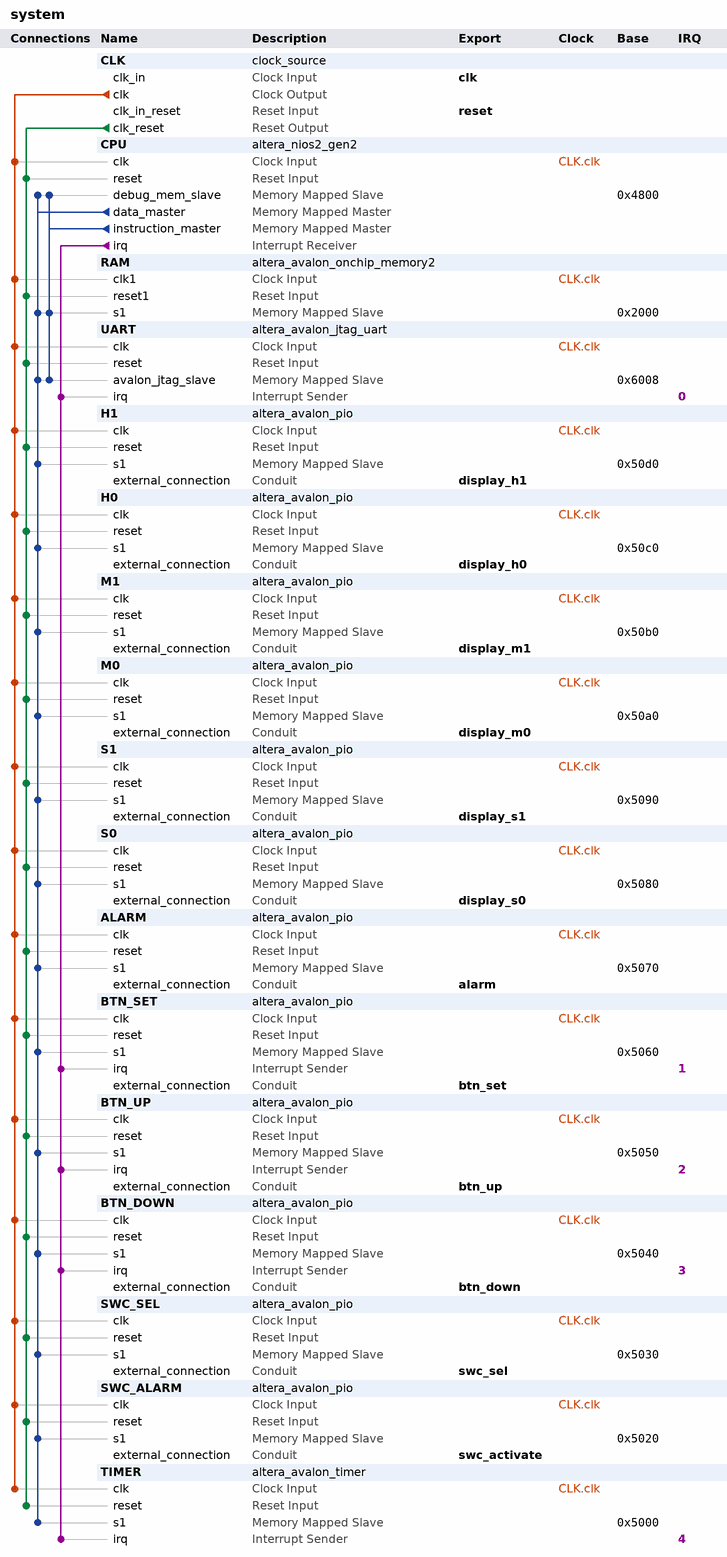
[diagram p0: system contents]
# Platform Designer (Qsys) system system, Cyclone V 5CEBA2F17A7
# Parameters at their usual value, and those the tool derives, are not listed.
package require -exact qsys 18.1
create_system system
set_project_property DEVICE_FAMILY {Cyclone V}
set_project_property DEVICE 5CEBA2F17A7

add_instance CLK clock_source 18.1
set_instance_parameter_value CLK clockFrequency 50000000

add_instance CPU altera_nios2_gen2 18.1
set_instance_parameter_value CPU dcache_size 2048
set_instance_parameter_value CPU exceptionSlave RAM.s1
set_instance_parameter_value CPU icache_size 4096
set_instance_parameter_value CPU impl Tiny
set_instance_parameter_value CPU resetSlave RAM.s1

add_instance RAM altera_avalon_onchip_memory2 18.1
set_instance_parameter_value RAM dataWidth 32
set_instance_parameter_value RAM dualPort false
set_instance_parameter_value RAM initMemContent true
set_instance_parameter_value RAM initializationFileName onchip_mem.hex
set_instance_parameter_value RAM memorySize 8192

add_instance UART altera_avalon_jtag_uart 18.1
set_instance_parameter_value UART simInteractiveOptions NO_INTERACTIVE_WINDOWS

add_instance H1 altera_avalon_pio 18.1
set_instance_parameter_value H1 direction Output
set_instance_parameter_value H1 width 4

add_instance H0 altera_avalon_pio 18.1
set_instance_parameter_value H0 direction Output
set_instance_parameter_value H0 width 4

add_instance M1 altera_avalon_pio 18.1
set_instance_parameter_value M1 direction Output
set_instance_parameter_value M1 width 4

add_instance M0 altera_avalon_pio 18.1
set_instance_parameter_value M0 direction Output
set_instance_parameter_value M0 width 4

add_instance S1 altera_avalon_pio 18.1
set_instance_parameter_value S1 direction Output
set_instance_parameter_value S1 width 4

add_instance S0 altera_avalon_pio 18.1
set_instance_parameter_value S0 direction Output
set_instance_parameter_value S0 width 4

add_instance ALARM altera_avalon_pio 18.1
set_instance_parameter_value ALARM direction Output
set_instance_parameter_value ALARM width 1

add_instance BTN_SET altera_avalon_pio 18.1
set_instance_parameter_value BTN_SET direction Input
set_instance_parameter_value BTN_SET generateIRQ true
set_instance_parameter_value BTN_SET simDoTestBenchWiring true
set_instance_parameter_value BTN_SET width 1

add_instance BTN_UP altera_avalon_pio 18.1
set_instance_parameter_value BTN_UP direction Input
set_instance_parameter_value BTN_UP generateIRQ true
set_instance_parameter_value BTN_UP simDoTestBenchWiring true
set_instance_parameter_value BTN_UP width 1

add_instance BTN_DOWN altera_avalon_pio 18.1
set_instance_parameter_value BTN_DOWN direction Input
set_instance_parameter_value BTN_DOWN generateIRQ true
set_instance_parameter_value BTN_DOWN simDoTestBenchWiring true
set_instance_parameter_value BTN_DOWN width 1

add_instance SWC_SEL altera_avalon_pio 18.1
set_instance_parameter_value SWC_SEL direction Input
set_instance_parameter_value SWC_SEL simDoTestBenchWiring true
set_instance_parameter_value SWC_SEL width 1

add_instance SWC_ALARM altera_avalon_pio 18.1
set_instance_parameter_value SWC_ALARM direction Input
set_instance_parameter_value SWC_ALARM simDoTestBenchWiring true
set_instance_parameter_value SWC_ALARM width 1

add_instance TIMER altera_avalon_timer 18.1
set_instance_parameter_value TIMER alwaysRun true
set_instance_parameter_value TIMER fixedPeriod true
set_instance_parameter_value TIMER period 100
set_instance_parameter_value TIMER periodUnits USEC
set_instance_parameter_value TIMER snapshot false

# connections
add_connection CLK.clk ALARM.clk clock
add_connection CLK.clk BTN_DOWN.clk clock
add_connection CLK.clk BTN_SET.clk clock
add_connection CLK.clk BTN_UP.clk clock
add_connection CLK.clk CPU.clk clock
add_connection CLK.clk H0.clk clock
add_connection CLK.clk H1.clk clock
add_connection CLK.clk M0.clk clock
add_connection CLK.clk M1.clk clock
add_connection CLK.clk RAM.clk1 clock
add_connection CLK.clk S0.clk clock
add_connection CLK.clk S1.clk clock
add_connection CLK.clk SWC_ALARM.clk clock
add_connection CLK.clk SWC_SEL.clk clock
add_connection CLK.clk TIMER.clk clock
add_connection CLK.clk UART.clk clock
add_connection CLK.clk_reset ALARM.reset reset
add_connection CLK.clk_reset BTN_DOWN.reset reset
add_connection CLK.clk_reset BTN_SET.reset reset
add_connection CLK.clk_reset BTN_UP.reset reset
add_connection CLK.clk_reset CPU.reset reset
add_connection CLK.clk_reset H0.reset reset
add_connection CLK.clk_reset H1.reset reset
add_connection CLK.clk_reset M0.reset reset
add_connection CLK.clk_reset M1.reset reset
add_connection CLK.clk_reset RAM.reset1 reset
add_connection CLK.clk_reset S0.reset reset
add_connection CLK.clk_reset S1.reset reset
add_connection CLK.clk_reset SWC_ALARM.reset reset
add_connection CLK.clk_reset SWC_SEL.reset reset
add_connection CLK.clk_reset TIMER.reset reset
add_connection CLK.clk_reset UART.reset reset
add_connection CPU.data_master ALARM.s1 avalon
set_connection_parameter_value CPU.data_master/ALARM.s1 baseAddress 0x5070
add_connection CPU.data_master BTN_DOWN.s1 avalon
set_connection_parameter_value CPU.data_master/BTN_DOWN.s1 baseAddress 0x5040
add_connection CPU.data_master BTN_SET.s1 avalon
set_connection_parameter_value CPU.data_master/BTN_SET.s1 baseAddress 0x5060
add_connection CPU.data_master BTN_UP.s1 avalon
set_connection_parameter_value CPU.data_master/BTN_UP.s1 baseAddress 0x5050
add_connection CPU.data_master CPU.debug_mem_slave avalon
set_connection_parameter_value CPU.data_master/CPU.debug_mem_slave baseAddress 0x4800
add_connection CPU.data_master H0.s1 avalon
set_connection_parameter_value CPU.data_master/H0.s1 baseAddress 0x50c0
add_connection CPU.data_master H1.s1 avalon
set_connection_parameter_value CPU.data_master/H1.s1 baseAddress 0x50d0
add_connection CPU.data_master M0.s1 avalon
set_connection_parameter_value CPU.data_master/M0.s1 baseAddress 0x50a0
add_connection CPU.data_master M1.s1 avalon
set_connection_parameter_value CPU.data_master/M1.s1 baseAddress 0x50b0
add_connection CPU.data_master RAM.s1 avalon
set_connection_parameter_value CPU.data_master/RAM.s1 baseAddress 0x2000
add_connection CPU.data_master S0.s1 avalon
set_connection_parameter_value CPU.data_master/S0.s1 baseAddress 0x5080
add_connection CPU.data_master S1.s1 avalon
set_connection_parameter_value CPU.data_master/S1.s1 baseAddress 0x5090
add_connection CPU.data_master SWC_ALARM.s1 avalon
set_connection_parameter_value CPU.data_master/SWC_ALARM.s1 baseAddress 0x5020
add_connection CPU.data_master SWC_SEL.s1 avalon
set_connection_parameter_value CPU.data_master/SWC_SEL.s1 baseAddress 0x5030
add_connection CPU.data_master TIMER.s1 avalon
set_connection_parameter_value CPU.data_master/TIMER.s1 baseAddress 0x5000
add_connection CPU.data_master UART.avalon_jtag_slave avalon
set_connection_parameter_value CPU.data_master/UART.avalon_jtag_slave baseAddress 0x6008
add_connection CPU.instruction_master CPU.debug_mem_slave avalon
set_connection_parameter_value CPU.instruction_master/CPU.debug_mem_slave baseAddress 0x4800
add_connection CPU.instruction_master RAM.s1 avalon
set_connection_parameter_value CPU.instruction_master/RAM.s1 baseAddress 0x2000
add_connection CPU.instruction_master UART.avalon_jtag_slave avalon
set_connection_parameter_value CPU.instruction_master/UART.avalon_jtag_slave baseAddress 0x6008
add_connection CPU.irq BTN_DOWN.irq interrupt
set_connection_parameter_value CPU.irq/BTN_DOWN.irq irqNumber 3
add_connection CPU.irq BTN_SET.irq interrupt
set_connection_parameter_value CPU.irq/BTN_SET.irq irqNumber 1
add_connection CPU.irq BTN_UP.irq interrupt
set_connection_parameter_value CPU.irq/BTN_UP.irq irqNumber 2
add_connection CPU.irq TIMER.irq interrupt
set_connection_parameter_value CPU.irq/TIMER.irq irqNumber 4
add_connection CPU.irq UART.irq interrupt
set_connection_parameter_value CPU.irq/UART.irq irqNumber 0

# exported interfaces
add_interface alarm conduit end
set_interface_property alarm EXPORT_OF ALARM.external_connection
add_interface btn_down conduit end
set_interface_property btn_down EXPORT_OF BTN_DOWN.external_connection
add_interface btn_set conduit end
set_interface_property btn_set EXPORT_OF BTN_SET.external_connection
add_interface btn_up conduit end
set_interface_property btn_up EXPORT_OF BTN_UP.external_connection
add_interface clk clock sink
set_interface_property clk EXPORT_OF CLK.clk_in
add_interface display_h0 conduit end
set_interface_property display_h0 EXPORT_OF H0.external_connection
add_interface display_h1 conduit end
set_interface_property display_h1 EXPORT_OF H1.external_connection
add_interface display_m0 conduit end
set_interface_property display_m0 EXPORT_OF M0.external_connection
add_interface display_m1 conduit end
set_interface_property display_m1 EXPORT_OF M1.external_connection
add_interface display_s0 conduit end
set_interface_property display_s0 EXPORT_OF S0.external_connection
add_interface display_s1 conduit end
set_interface_property display_s1 EXPORT_OF S1.external_connection
add_interface reset reset sink
set_interface_property reset EXPORT_OF CLK.clk_in_reset
add_interface swc_activate conduit end
set_interface_property swc_activate EXPORT_OF SWC_ALARM.external_connection
add_interface swc_sel conduit end
set_interface_property swc_sel EXPORT_OF SWC_SEL.external_connection

set_interconnect_requirement {$system} qsys_mm.clockCrossingAdapter HANDSHAKE
set_interconnect_requirement {$system} qsys_mm.enableEccProtection FALSE
set_interconnect_requirement {$system} qsys_mm.insertDefaultSlave FALSE
set_interconnect_requirement {$system} qsys_mm.maxAdditionalLatency 1

save_system system.qsys
